# EAGLE design HID2AMI.Deluxe.Rev1.0.0.redist (EAGLE 9.1.3)
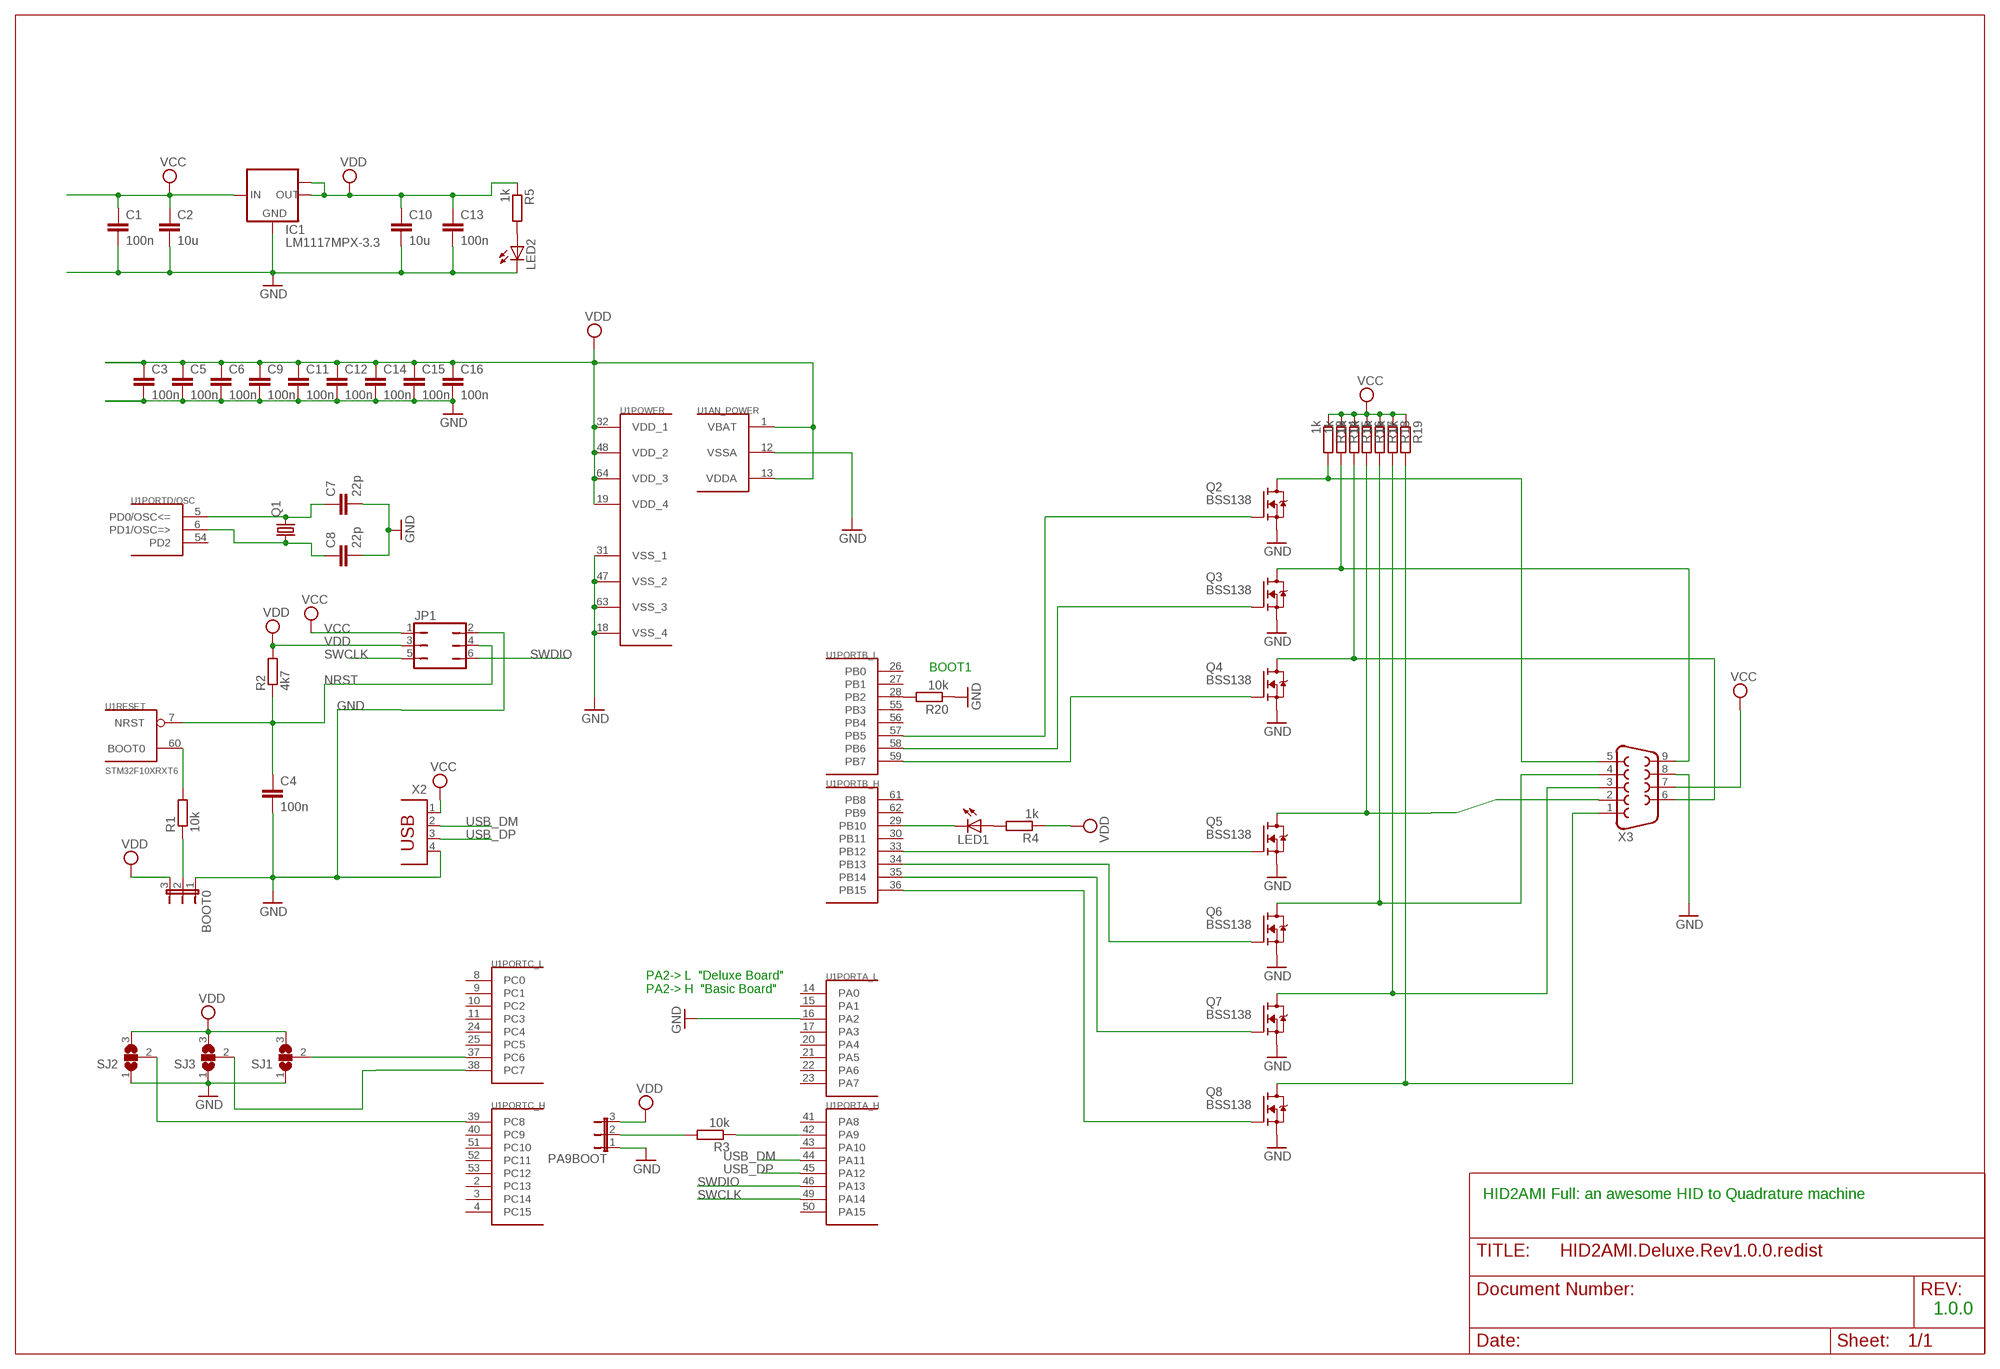
[diagram p0: schematic, sheet 1]

## Parts
BOOT0  JP2E  [JP2]
C1  100n  C-EUC0805  [C0805]
C2  10u  C-EUC1206  [C1206]
C3  100n  C-EUC0805  [C0805]
C4  100n  C-EUC0805  [C0805]
C5  100n  C-EUC0805  [C0805]
C6  100n  C-EUC0805  [C0805]
C7  22p  C-EUC0805  [C0805]
C8  22p  C-EUC0805  [C0805]
C9  100n  C-EUC0805  [C0805]
C10  10u  C-EUC0805  [C0805]
C11  100n  C-EUC0805  [C0805]
C12  100n  C-EUC0805  [C0805]
C13  100n  C-EUC0805  [C0805]
C14  100n  C-EUC0805  [C0805]
C15  100n  C-EUC0805  [C0805]
C16  100n  C-EUC0805  [C0805]
IC1  LM1117MPX-3.3  [SOT223]
JP1  JP3Q  [JP3Q]
LED1  LEDSML0805  [SML0805]
LED2  LEDSML0805  [SML0805]
PA9BOOT  JP2E  [JP2]
Q1  CRYSTALHC49S  [HC49/S]
Q2  BSS138  [SOT23]
Q3  BSS138  [SOT23]
Q4  BSS138  [SOT23]
Q5  BSS138  [SOT23]
Q6  BSS138  [SOT23]
Q7  BSS138  [SOT23]
Q8  BSS138  [SOT23]
R1  10k  R-EU_M0805  [M0805]
R2  4k7  R-EU_M0805  [M0805]
R3  10k  R-EU_M0805  [M0805]
R4  1k  R-EU_M0805  [M0805]
R5  1k  R-EU_M0805  [M0805]
R13  1k  R-EU_M0805  [M0805]
R14  1k  R-EU_M0805  [M0805]
R15  1k  R-EU_M0805  [M0805]
R16  1k  R-EU_M0805  [M0805]
R17  1k  R-EU_M0805  [M0805]
R18  1k  R-EU_M0805  [M0805]
R19  1k  R-EU_M0805  [M0805]
R20  10k  R-EU_M0805  [M0805]
SJ1  SJ2W  [SJ_2]
SJ2  SJ2W  [SJ_2]
SJ3  SJ2W  [SJ_2]
U1  STM32F10XRXT6  [TQFP64]
X2  PN87520  [PN87520]
X3  F09HP  [F09HP]

## Nets
GND: BOOT0.1 C1.2 C2.2 C3.2 C4.2 C5.2 C6.2 C7.2 C8.2 C9.2 C10.2 C11.2 C12.2 C13.2 C14.2 C15.2 C16.2 IC1.1(GND) JP1.2 LED2.C PA9BOOT.1 Q2.2(S) Q3.2(S) Q4.2(S) Q5.2(S) Q6.2(S) Q7.2(S) Q8.2(S) R20.1 SJ1.1 SJ2.1 SJ3.1 U1.12(AN_POWER:VSSA) U1.16(PORTA_L:PA2) U1.18(POWER:VSS_4) U1.31(POWER:VSS_1) U1.47(POWER:VSS_2) U1.63(POWER:VSS_3) X2.4 X3.8
N$1: C7.1 Q1.2 U1.5(PORTD/OSC:PD0/OSC<=)
N$2: C8.1 Q1.1 U1.6(PORTD/OSC:PD1/OSC=>)
N$3: R1.2 U1.60(RESET:BOOT0)
N$4: BOOT0.2 R1.1
N$5: PA9BOOT.2 R3.2
N$6: R3.1 U1.42(PORTA_H:PA9)
N$7: LED1.A R4.2
N$8: LED1.C U1.29(PORTB_H:PB10)
N$9: SJ1.2 U1.37(PORTC_L:PC6)
N$10: SJ3.2 U1.38(PORTC_L:PC7)
N$11: SJ2.2 U1.39(PORTC_H:PC8)
N$12: LED2.A R5.2
N$13: Q2.1(G) U1.57(PORTB_L:PB5)
N$14: Q3.1(G) U1.58(PORTB_L:PB6)
N$15: Q4.1(G) U1.59(PORTB_L:PB7)
N$16: Q5.1(G) U1.33(PORTB_H:PB12)
N$17: Q6.1(G) U1.34(PORTB_H:PB13)
N$18: Q7.1(G) U1.35(PORTB_H:PB14)
N$19: Q8.1(G) U1.36(PORTB_H:PB15)
N$20: R20.2 U1.28(PORTB_L:PB2)
N$34: Q2.3(D) R13.2 X3.5
N$35: Q3.3(D) R14.2 X3.9
N$36: Q4.3(D) R15.2 X3.6
N$37: Q5.3(D) R16.2 X3.2
N$38: Q6.3(D) R17.2 X3.4
N$39: Q7.3(D) R18.2 X3.3
N$40: Q8.3(D) R19.2 X3.1
NRST: C4.1 JP1.4 R2.1 U1.7(RESET:NRST)
SWCLK: JP1.5 U1.49(PORTA_H:PA14)
SWDIO: JP1.6 U1.46(PORTA_H:PA13)
USB_DM: U1.44(PORTA_H:PA11) X2.2
USB_DP: U1.45(PORTA_H:PA12) X2.3
VCC: C1.1 C2.1 IC1.3(IN) JP1.1 R13.1 R14.1 R15.1 R16.1 R17.1 R18.1 R19.1 X2.1 X3.7
VDD: BOOT0.3 C3.1 C5.1 C6.1 C9.1 C10.1 C11.1 C12.1 C13.1 C14.1 C15.1 C16.1 IC1.2(OUT) IC1.TAB(OUT1) JP1.3 PA9BOOT.3 R2.2 R4.1 R5.1 SJ1.3 SJ2.3 SJ3.3 U1.1(AN_POWER:VBAT) U1.13(AN_POWER:VDDA) U1.19(POWER:VDD_4) U1.32(POWER:VDD_1) U1.48(POWER:VDD_2) U1.64(POWER:VDD_3)
Unconnected: U1.2(PORTC_H:PC13) U1.3(PORTC_H:PC14) U1.4(PORTC_H:PC15) U1.8(PORTC_L:PC0) U1.9(PORTC_L:PC1) U1.10(PORTC_L:PC2) U1.11(PORTC_L:PC3) U1.14(PORTA_L:PA0) U1.15(PORTA_L:PA1) U1.17(PORTA_L:PA3) U1.20(PORTA_L:PA4) U1.21(PORTA_L:PA5) U1.22(PORTA_L:PA6) U1.23(PORTA_L:PA7) U1.24(PORTC_L:PC4) U1.25(PORTC_L:PC5) U1.26(PORTB_L:PB0) U1.27(PORTB_L:PB1) U1.30(PORTB_H:PB11) U1.40(PORTC_H:PC9) U1.41(PORTA_H:PA8) U1.43(PORTA_H:PA10) U1.50(PORTA_H:PA15) U1.51(PORTC_H:PC10) U1.52(PORTC_H:PC11) U1.53(PORTC_H:PC12) U1.54(PORTD/OSC:PD2) U1.55(PORTB_L:PB3) U1.56(PORTB_L:PB4) U1.61(PORTB_H:PB8) U1.62(PORTB_H:PB9)

## Notes on the sheet
- BOOT1
- PA2-> L  "Deluxe Board"
  PA2-> H  "Basic Board"
- HID2AMI Full: an awesome HID to Quadrature machine
- 1.0.0

## Library data of the parts
BOOT0 PA9BOOT = jumper:JP2E: JUMPER
C1-C16 = rcl:C-EU: CAPACITOR, European symbol; SPICEPREFIX: C
IC1 = lm1117:LM1117MPX-*
JP1 = jumper:JP3Q: JUMPER
LED1 LED2 = led:LED: LED OSRAM: - CHIPLED LG R971, LG N971, LY N971, LG Q971, LY Q971, LO R971, LY R971 LH N974, LH R974 LS Q976, LO Q976, LY Q976 LO Q996 - Hyper CHIPLED LW Q18S LB Q993, LB Q99A, LB R99A - SideLED LS A670, LO A670, LY A670, LG A670, LP A670 LB A673, LV A673, LT A673, LW A673 LH A674 LY A675 LS A676, LA A676, LO A676, LY A676, LW A676 LS A679, LY A679, LG A679 - Hyper Micro SIDELED® LS Y876, LA Y876, LO Y876, LY Y876 LT Y87S - SmartLED LW L88C, LW L88S LB L89C, LB L89S, LG L890 LS L89K, LO L89K, LY L89K LS L896, LA L896, LO L896, LY L896 - TOPLED LS T670, LO T670, LY T670, LG T670, LP T670 LSG T670, LSP T670, LSY T670, LOP T670, LYG T670 LG T671, LOG T671, LSG T671 LB T673, LV T673, LT T673, LW T673 LH T674 LS T676, LA T676, LO T676, LY T676, LB T676, LH T676, LSB T676, LW T676 LB T67C, LV T67C, LT T67C, LS T67K, LO T67K, LY T67K, LW E67C LS E67B, LA E67B, LO E67B, LY E67B, LB E67C, LV E67C, LT E67C LW T67C LS T679, LY T679, LG T679 LS T770, LO T770, LY T770, LG T770, LP T770 LB T773, LV T773, LT T773, LW T773 LH T774 LS E675, LA E675, LY E675, LS T675 LS T776, LA T776, LO T776, LY T776, LB T776 LHGB T686 LT T68C, LB T68C - Hyper Mini TOPLED® LB M676 - Mini TOPLED Santana® LG M470 LS M47K, LO M47K, LY M47K Source: http://www.osram.convergy.de LUXEON: - LUMILED® LXK2-PW12-R00, LXK2-PW12-S00, LXK2-PW14-U00, LXK2-PW14-V00 LXK2-PM12-R00, LXK2-PM12-S00, LXK2-PM14-U00 LXK2-PE12-Q00, LXK2-PE12-R00, LXK2-PE12-S00, LXK2-PE14-T00, LXK2-PE14-U00 LXK2-PB12-K00, LXK2-PB12-L00, LXK2-PB12-M00, LXK2-PB14-N00, LXK2-PB14-P00, LXK2-PB14-Q00 LXK2-PR12-L00, LXK2-PR12-M00, LXK2-PR14-Q00, LXK2-PR14-R00 LXK2-PD12-Q00, LXK2-PD12-R00, LXK2-PD12-S00 LXK2-PH12-R00, LXK2-PH12-S00 LXK2-PL12-P00, LXK2-PL12-Q00, LXK2-PL12-R00 Source: www.luxeon.com KINGBRIGHT: KA-3528ASYC Source: www.kingbright.com
Q1 = crystal:CRYSTAL: CRYSTAL; OC_FARNELL: 1667008; OC_NEWARK: unknown
Q2-Q8 = bss138_10:BSS138: BSS138 N-Channel Logic Level Enhancement Mode Field Effect Transistor Source: http://www.fairchildsemi.com/datasheets/BS/BSS138.pdf; MF: Fairchild; MPN: BSS138; OC_FARNELL: 9845330; OC_NEWARK: 67R2009
R1-R5 R13-R20 = rcl:R-EU_: RESISTOR, European symbol; SPICEPREFIX: R
SJ1-SJ3 = jumper:SJ2W: SMD solder JUMPER
U1 = stm32:STM32F10XRXT6: STM32F101/103 64pin LQFP
X2 = con-berg:PN87520: BERG USB connector; OC_FARNELL: unknown; OC_NEWARK: unknown
X3 = con-subd:F09: SUB-D; OC_FARNELL: unknown; OC_NEWARK: unknown

## Board
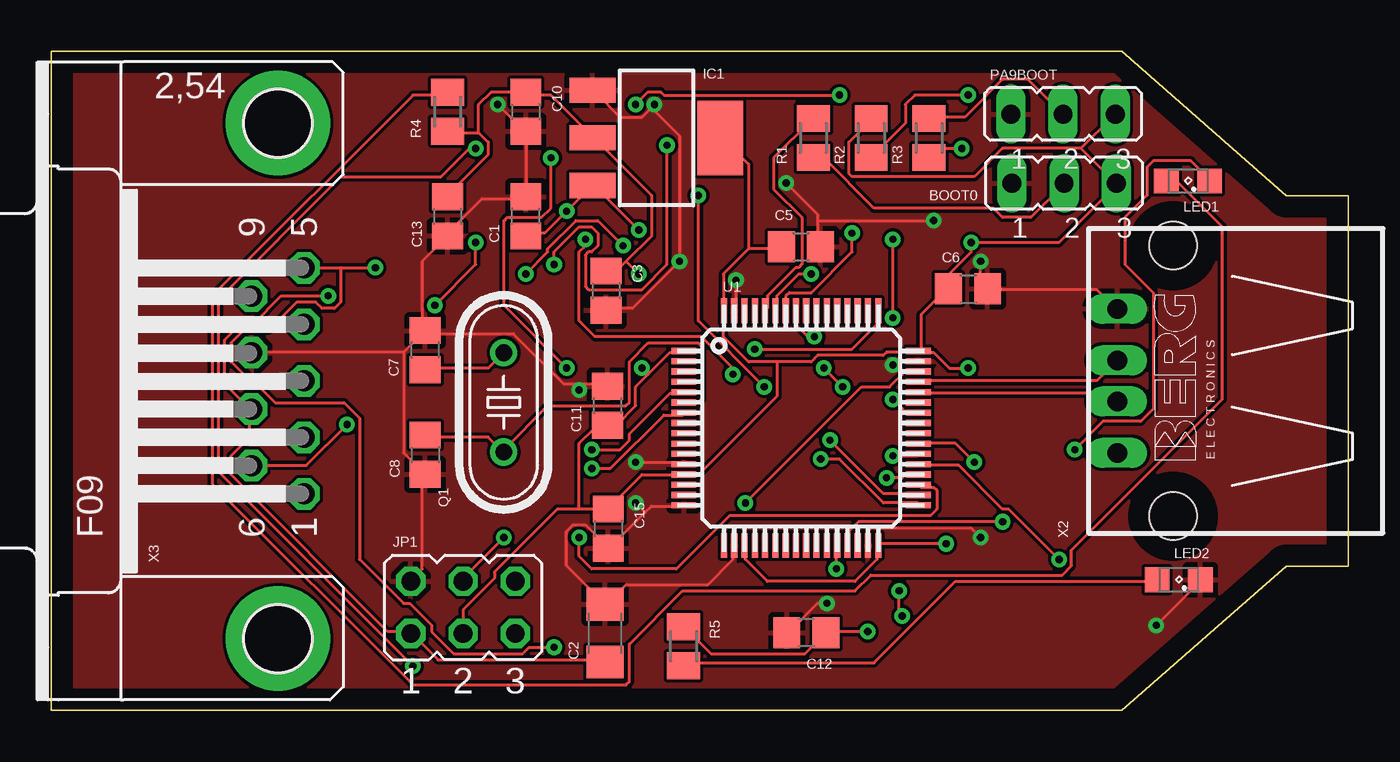
[diagram p1: board, top side]
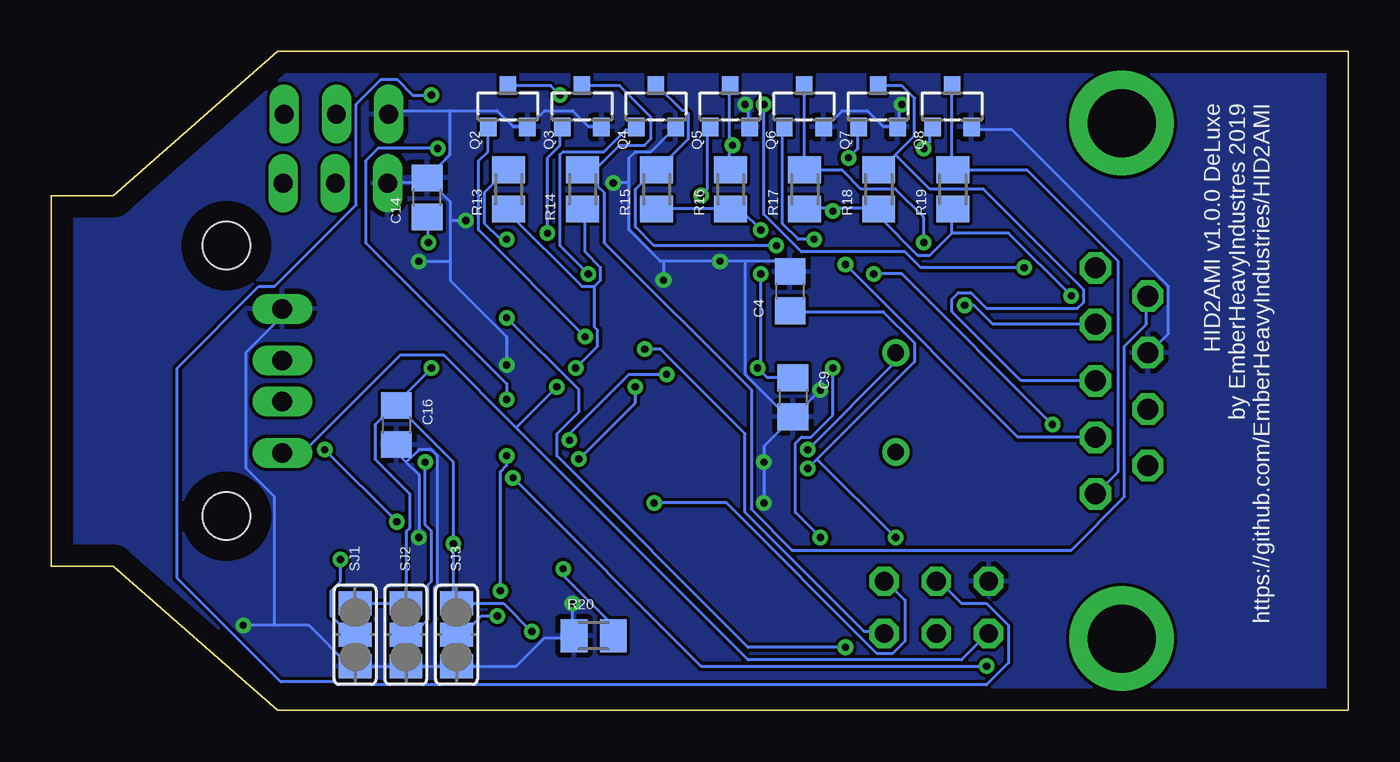
[diagram p2: board, bottom side, seen from below]

Size 63 x 32 mm. Coordinates in mm from the lower left corner, seen from the top.
Outline: 0,32 52,32 60,25 63,25 63,7 60,7 52,0 0,0 0,32
Copper layers (1*16): Top 0.035mm / dielectric 1.5mm / Bottom 0.035mm
Design rules "default": minimum track width 6mil, minimum drill 0.35mm, track to track 6mil, track to pad 6mil, pad to pad 6mil, via to via 6mil, smd to smd 6mil, copper to edge 40mil, drill to drill 6mil, minimum pad ring 10mil, minimum via ring 8mil, stop-mask expansion 4mil, vias tented up to drill 0mil, thermal gap 10mil

### Footprints (pad centres in the part's own frame; a part is rotated, then mirrored left to right if it is on the bottom)
JP2 = drill 0.914 long: 1 -2.54,0; 2 0,0; 3 2.54,0
C0805 = smd 1.3 x 1.5: 1 -0.95,0; 2 0.95,0
C1206 = smd 1.6 x 1.8: 1 -1.4,0; 2 1.4,0
SOT223 = smd 1.219 x 2.235: 1 -2.311,-3.099; 2 0,-3.099; 3 2.311,-3.099 | smd 3.6 x 2.2: TAB 0,3.099
JP3Q = drill 0.914 octagon: 1 -2.54,-1.27; 2 -2.54,1.27; 3 0,-1.27; 4 0,1.27; 5 2.54,-1.27; 6 2.54,1.27
SML0805 = smd 1.2 x 1.2: A 1.05,0; C -1.05,0
HC49/S = drill 0.813: 1 -2.413,0; 2 2.413,0
SOT23 = smd 0.8 x 0.9: 1 -0.95,-1; 2 0.95,-1; 3 0,1
M0805 = smd 1.3 x 1.6: 1 -0.95,0; 2 0.95,0
SJ_2 = smd 1.168 x 1.6: 1 -1.524,0; 2 0,0; 3 1.524,0
TQFP64 = smd 1.2 x 0.3: 1 -5.7,3.75; 2 -5.7,3.25; 3 -5.7,2.75; 4 -5.7,2.25; 5 -5.7,1.75; 6 -5.7,1.25; 7 -5.7,0.75; 8 -5.7,0.25; 9 -5.7,-0.25; 10 -5.7,-0.75; 11 -5.7,-1.25; 12 -5.7,-1.75; 13 -5.7,-2.25; 14 -5.7,-2.75; 15 -5.7,-3.25; 16 -5.7,-3.75; 33 5.7,-3.75; 34 5.7,-3.25; 35 5.7,-2.75; 36 5.7,-2.25; 37 5.7,-1.75; 38 5.7,-1.25; 39 5.7,-0.75; 40 5.7,-0.25; 41 5.7,0.25; 42 5.7,0.75; 43 5.7,1.25; 44 5.7,1.75; 45 5.7,2.25; 46 5.7,2.75; 47 5.7,3.25; 48 5.7,3.75 | smd 0.3 x 1.2: 17 -3.75,-5.7; 18 -3.25,-5.7; 19 -2.75,-5.7; 20 -2.25,-5.7; 21 -1.75,-5.7; 22 -1.25,-5.7; 23 -0.75,-5.7; 24 -0.25,-5.7; 25 0.25,-5.7; 26 0.75,-5.7; 27 1.25,-5.7; 28 1.75,-5.7; 29 2.25,-5.7; 30 2.75,-5.7; 31 3.25,-5.7; 32 3.75,-5.7; 49 3.75,5.7; 50 3.25,5.7; 51 2.75,5.7; 52 2.25,5.7; 53 1.75,5.7; 54 1.25,5.7; 55 0.75,5.7; 56 0.25,5.7; 57 -0.25,5.7; 58 -0.75,5.7; 59 -1.25,5.7; 60 -1.75,5.7; 61 -2.25,5.7; 62 -2.75,5.7; 63 -3.25,5.7; 64 -3.75,5.7
PN87520 = drill 0.95 long: 1 -3.5,2.71; 2 -1,2.71; 3 1,2.71; 4 3.5,2.71 | hole 2.3: -6.57,0; 6.57,0
F09HP = drill 1.016 octagon: 1 -5.486,-1.27; 2 -2.743,-1.27; 3 0,-1.27; 4 2.743,-1.27; 5 5.486,-1.27; 6 -4.115,1.27; 7 -1.372,1.27; 8 1.372,1.27; 9 4.115,1.27 | drill 3.302 pad 5.08: G1 -12.522,0; G2 12.522,0

### Placement (x,y rotation side)
BOOT0  49.21,25.6 0 top
C1  23.05,23.99 90 top
C2  26.9,3.75 90 top
C3  26.95,20.38 270 top
C4  27.1,20.36 90 bottom
C5  36.42,22.52 0 top
C6  44.54,20.47 0 top
C7  18.16,17.5 90 top
C8  18.16,12.42 270 top
C9  26.97,15.2 270 bottom
C10  23.05,29.07 270 top
C11  27.03,14.8 90 top
C12  36.68,3.77 180 top
C13  19.24,23.99 270 top
C14  44.74,24.91 90 bottom
C15  27.05,8.83 270 top
C16  46.24,13.86 270 bottom
IC1  29.4,27.8 270 top
JP1  20,5 0 top
LED1  55.23,25.71 180 top
LED2  54.77,6.34 180 top
PA9BOOT  49.15,28.96 0 top
Q1  21.97,14.96 90 top
Q2  40.82,29.34 0 bottom
Q3  37.22,29.34 0 bottom
Q4  33.63,29.34 0 bottom
Q5  30.03,29.34 0 bottom
Q6  26.43,29.34 0 bottom
Q7  22.84,29.34 0 bottom
Q8  19.24,29.34 0 bottom
R1  37.02,27.8 90 top
R2  39.83,27.8 90 top
R3  42.64,27.8 90 top
R4  19.24,29.07 90 top
R5  30.72,3.11 270 top
R13  40.79,25.3 90 bottom
R14  37.19,25.3 90 bottom
R15  33.6,25.3 90 bottom
R16  30,25.3 90 bottom
R17  26.4,25.3 90 bottom
R18  22.81,25.3 90 bottom
R19  19.21,25.3 90 bottom
R20  36.66,3.62 0 bottom
SJ1  48.24,3.67 90 bottom
SJ2  45.78,3.67 90 bottom
SJ3  43.32,3.67 90 bottom
U1  36.43,13.7 0 top
X2  54.5,16 90 top
X3  11,16 90 top

### Tracks (layer width: path | path; a pad name or v marks a point on that pad's centre or on a via)
GND  (via drill 0.35)
  Top 0.152: v40.88,16.78 41.03,16.93 42.1,16.93 U1.47 | v45.15,8.39 44.69,8.85 39.81,8.85 39.66,8.7 39.66,8.09 U1.31 | X2.4 51.7,19.52 50.79,20.43 45.6,20.43 C6.2 45.45,20.59 45.15,20.89 v45.15,21.81 | v37.68,5.19 37.22,5.19 35.85,3.82 C12.2 | v53.68,4.13 55.82,6.26 LED2.C | 29.15,29.27 28.69,28.82 27.62,28.82 26.4,30.03 IC1.1 | 29.15,29.27 30.52,27.9 v30.52,21.81 28.23,19.52 27.01,19.52 C3.2 | 29.15,29.27 v29.3,29.43 | 28.84,9.61 27.16,7.94 C15.2 27.01,7.94 25.95,9 25.34,9 25.03,8.7 25.03,7.02 26.86,5.19 C2.2 27.01,5.19 27.93,6.11 31.89,6.11 33.11,7.33 33.11,7.94 U1.18 | 28.84,9.61 29.15,9.92 30.67,9.92 U1.16 | v28.38,12.05 30.67,12.05 U1.12 | v33.26,20.89 33.26,19.52 U1.63 | 37.22,23.79 37.22,24.09 v35.7,25.62 | 37.22,23.79 37.22,22.57 C5.2 | v28.38,10.07 28.84,9.61 | JP1.2 17.56,6.41 18.02,6.87 18.02,11.44 C8.2 18.02,11.59 17.11,12.51 17.11,17.39 | 23.05,28.05 C1.2 23.05,24.85 20.92,24.85 19.24,23.18 C13.2 19.24,23.02 18.02,21.81 18.02,18.45 C7.2 | 23.05,28.05 v21.68,29.43 | 23.05,28.05 C10.2 | 25.64,15.86 24.88,15.86 22.44,18.3 18.17,18.3 C7.2 | 25.64,15.86 27.01,15.86 C11.2 | 17.11,17.39 18.02,18.3 C7.2 | 17.11,17.39 9.79,17.39 X3.8 | 25.64,15.86 v25.64,15.56 | 37.22,23.79 v42.86,23.79
  Bottom 0.152: Q3.2 36.31,28.36 36.92,28.36 37.68,29.12 39.05,29.12 39.81,28.36 Q2.2 39.97,28.36 40.58,28.36 41.34,29.12 43.62,29.12 | 43.62,29.12 46.37,29.12 46.52,28.97 PA9BOOT.1 | v40.88,16.78 40.88,18.15 43.62,20.89 43.62,21.81 | 43.62,23.79 43.62,24.7 44.69,25.77 C14.2 | 43.62,23.79 43.62,21.81 | BOOT0.1 46.52,25.62 45,25.62 44.84,25.77 C14.2 | 43.62,29.12 43.62,26.99 44.69,25.92 C14.2 | v45.15,8.39 45.15,11.44 45.76,12.05 | 45.76,12.05 46.22,12.51 46.22,12.81 C16.2 | v37.68,5.19 37.68,3.67 R20.1 37.68,3.52 39.05,3.52 40.42,2.15 SJ3.1 44.39,2.15 | 44.39,2.15 SJ2.1 SJ1.1 48.5,2.15 50.48,4.13 52.16,4.13 | 52.16,4.13 v53.68,4.13 | 52.16,4.13 52.16,10.38 53.53,11.75 53.53,17.39 51.85,19.06 51.85,19.37 X2.4 | 45.76,12.05 45.15,12.66 44.54,12.66 44.23,12.36 44.23,6.11 44.39,5.96 44.39,2.15 | v45.15,21.81 43.62,21.81 | v29.3,29.43 29.15,29.27 29.15,28.36 Q5.2 | C9.2 27.01,14.19 28.38,12.81 v28.38,12.05 v28.38,10.07 | 34.94,25.62 34.94,23.33 33.41,21.81 33.26,21.81 | 34.94,25.62 34.94,26.84 34.63,27.14 33.87,27.14 32.8,28.21 Q4.2 | 29.3,21.81 27.62,21.81 27.16,21.35 C4.2 | 29.3,21.81 v30.52,21.81 33.26,21.81 | 33.26,21.81 v33.26,20.89 | 34.94,25.62 v35.7,25.62 | 29.3,21.81 29.3,16.32 27.32,14.34 27.01,14.34 C9.2 | Q8.2 18.17,28.21 16.34,28.21 8.72,20.59 8.72,18.3 9.64,17.39 X3.8 | Q6.2 25.34,28.36 24.57,29.12 23.36,29.12 22.59,28.36 21.98,28.36 Q7.2 21.83,28.36 21.83,29.27 v21.68,29.43 | v25.64,15.56 26.86,14.34 C9.2 | v42.86,23.79 43.62,23.79
  pour Top: 0,32 52,32 60,25 63,25 63,7 60,7 52,0 0,0
  pour Bottom: 0,32 52,32 60,25 63,25 63,7 60,7 52,0 0,0
N$1  (via drill 0.35)
  Top 0.152: v26.25,12.66 27.62,12.66 28.08,13.12 28.08,13.42 30.06,15.41 30.67,15.41 U1.5 | C7.1 18.17,16.62 21.22,16.62 21.83,17.23 Q1.2
  Bottom 0.152: v26.25,12.66 21.98,16.93 21.98,17.23 Q1.2
N$2
  Top 0.152: U1.6 30.82,14.95 31.43,14.95 31.58,15.1 31.58,17.69 31.43,17.84 28.99,17.84 28.08,16.93 28.08,14.95 27.93,14.8 24.12,14.8 21.98,12.66 Q1.1 21.83,12.66 21.22,13.27 18.17,13.27 C8.1
N$3
  Top 0.152: U1.60 34.78,19.52 34.78,20.13 36.16,21.5 36.31,21.5 36.46,21.65 36.46,23.94 35.09,25.31 35.09,26.84 36.92,28.66 R1.2
N$4
  Top 0.152: R1.1 37.07,26.84 37.53,26.84 39.97,24.4 45.76,24.4 46.22,23.94 47.59,23.94 49.11,25.46 BOOT0.2
N$5
  Top 0.152: R3.2 42.71,28.82 44.39,28.82 46.22,30.65 47.43,30.65 49.11,28.97 PA9BOOT.2
N$6  (via drill 0.35)
  Top 0.152: v40.88,15.1 41.49,14.49 42.1,14.49 U1.42 | v44.23,27.29 43.01,27.29 42.71,26.99 R3.1
  Bottom 0.152: v40.88,15.1 40.88,15.86 47.74,22.72 47.74,26.68 47.13,27.29 v44.23,27.29
N$7
  Top 0.152: LED1.A 54.29,25.62 54.75,25.62 56.88,23.48 56.88,15.1 49.57,7.79 49.57,7.02 49.11,6.57 39.81,6.57 39.05,5.8 30.67,5.8 28.08,3.21 28.08,1.38 27.93,1.23 17.56,1.23 7.81,10.98 7.81,20.13 17.56,29.88 19.24,29.88 R4.2
N$8  (via drill 0.35)
  Top 0.152: v46.22,9.16 39.2,9.16 38.75,8.7 38.75,8.09 U1.29 | v49.72,12.66 51.09,14.03 52.92,14.03 53.53,14.64 53.53,20.28 52.16,21.65 52.16,23.94 53.23,25.01 53.23,26.38 53.53,26.68 55.36,26.68 56.27,25.77 LED1.C
  Bottom 0.152: v49.72,12.66 v46.22,9.16
N$9  (via drill 0.35)
  Top 0.152: v48.96,7.33 46.52,9.77 46.22,9.77 44.08,11.9 42.25,11.9 U1.37
  Bottom 0.152: v48.96,7.33 48.96,6.26 49.41,5.8 49.41,4.58 48.5,3.67 SJ1.2
N$10  (via drill 0.35)
  Top 0.152: v40.88,12.36 42.1,12.36 U1.38 | v41.19,5.8 41.19,4.74 v41.34,4.58
  Bottom 0.152: v40.88,12.36 40.88,11.9 41.19,11.59 v41.19,5.8 | v41.34,4.58 42.1,4.58 43.01,3.67 SJ3.2
N$11  (via drill 0.35)
  Top 0.152: v44.84,12.05 43.93,12.97 42.25,12.97 U1.39
  Bottom 0.152: v44.84,12.05 44.84,9 44.54,8.7 44.54,6.26 44.69,6.11 44.69,4.43 45.45,3.67 SJ2.2
N$12
  Top 0.152: LED2.A 53.68,6.26 43.93,6.26 39.97,2.3 30.82,2.3 R5.2
N$13  (via drill 0.35)
  Top 0.152: v37.07,18.15 36.77,18.15 36.16,18.76 36.16,19.37 U1.57
  Bottom 0.152: v37.07,18.15 42.25,23.33 42.25,26.68 41.8,27.14 41.8,28.21 Q2.1
N$14  (via drill 0.35)
  Top 0.152: v38.9,23.18 38.9,22.26 36.92,20.28 35.85,20.28 35.7,20.13 35.7,19.52 U1.58
  Bottom 0.152: v38.9,23.18 38.9,26.84 38.29,27.44 38.29,28.21 Q3.1
N$15  (via drill 0.35)
  Top 0.152: v36.92,21.2 36.31,21.2 35.24,20.13 35.24,19.52 U1.59
  Bottom 0.152: v36.92,21.2 38.29,22.57 38.29,26.99 38.14,27.14 36.16,27.14 35.09,28.21 34.63,28.21 Q4.1
N$16  (via drill 0.35)
  Top 0.152: v31.43,25.01 31.43,18.91 v34.63,15.71 | v37.38,12.2 38.29,12.2 40.42,10.07 42.1,10.07 U1.33
  Bottom 0.152: v31.43,25.01 31.13,25.31 31.13,28.21 Q5.1 | v34.63,15.71 34.63,14.95 v37.38,12.2
N$17  (via drill 0.35)
  Top 0.152: v25.95,22.87 25.95,22.57 25.64,22.26 25.64,18.91 26.4,18.15 31.58,18.15 33.11,16.62 v33.11,16.32 | v37.83,13.12 40.42,10.53 42.1,10.53 U1.34
  Bottom 0.152: v25.95,22.87 26.71,22.87 27.47,23.63 27.47,28.21 Q6.1 | v33.11,16.32 34.94,16.32 37.83,13.42 v37.83,13.12
N$18  (via drill 0.35)
  Top 0.152: v24.27,26.84 24.27,24.4 23.81,23.94 22.14,23.94 21.98,23.79 21.98,19.67 v25.03,16.62 | v25.64,8.39 25.64,7.48 26.25,6.87 30.36,6.87 32.96,9.46 42.71,9.46 43.01,9.77 43.01,10.68 42.86,10.83 42.25,10.83 U1.35
  Bottom 0.152: v24.27,26.84 23.81,27.29 23.81,28.21 Q7.1 | v25.03,16.62 25.03,14.34 26.1,13.27 26.55,13.27 26.86,12.97 26.86,9.61 v25.64,8.39
N$19  (via drill 0.35)
  Top 0.152: v20.61,27.29 20.31,27.29 18.94,25.92 14.06,25.92 8.12,19.98 8.12,11.59 v17.56,2.15 | v40.58,11.29 41.34,11.29 41.49,11.44 42.1,11.44 U1.36
  Bottom 0.152: v20.61,27.29 20.31,27.6 20.31,28.21 Q8.1 | v17.56,2.15 31.43,2.15 v40.58,11.29
N$20  (via drill 0.35)
  Top 0.152: v38.14,6.87 38.14,7.94 U1.28
  Bottom 0.152: v38.14,6.87 38.14,6.57 35.85,4.28 35.85,3.67 R20.2
N$34  (via drill 0.35)
  Top 0.152: v38.29,29.88 29.76,29.88 29.6,30.03 28.99,30.03 v28.38,29.43 | 14.06,21.5 12.38,21.5 X3.5 | 14.06,21.5 v15.73,21.5 | v40.88,19.06 v40.88,22.87 | v24.42,3.06 23.2,3.06 22.9,2.76 19.55,2.76 18.48,3.82 18.48,4.13 17.41,5.19 17.11,5.19 14.97,7.33 14.97,14.19 14.21,14.95 10.86,14.95 9.49,16.32 9.33,16.32 8.72,16.93 8.72,17.84 9.33,18.45 10.55,18.45 11.93,19.82 12.84,19.82 13.14,19.52 13.75,19.52 14.06,19.82 14.06,21.5
  Bottom 0.152: Q2.3 38.75,30.34 v38.29,29.88 | v28.38,29.43 28.38,24.09 26.55,22.26 21.53,22.26 20.76,21.5 v15.73,21.5 | v40.88,22.87 41.19,22.87 41.95,23.63 41.95,25.16 40.88,26.23 R13.2 | v40.88,19.06 37.38,15.56 37.38,14.49 38.44,13.42 38.44,12.36 29.15,3.06 v24.42,3.06
N$35
  Bottom 0.152: Q3.3 35.39,30.34 33.87,28.82 33.87,27.75 34.17,27.44 35.39,27.44 36.46,26.38 | 36.46,26.38 37.07,26.38 R14.2 36.46,26.38 | 36.46,26.38 36.46,25.46 36.16,25.16 36.16,22.72 28.99,15.56 28.99,9.77 27.01,7.79 13.45,7.79 10.86,10.38 10.86,17.69 9.79,18.76 9.79,19.98 X3.9
N$36  (via drill 0.35)
  Top 0.152: v27.77,22.57 26.55,23.79 25.49,23.79 24.12,22.41 24.12,22.26 v23.05,21.2 | v14.36,13.88 12.38,11.9 9.79,11.9 X3.6
  Bottom 0.152: Q4.3 33.57,30.34 32.35,29.12 32.19,29.12 32.04,28.97 32.04,27.75 33.57,26.23 R15.2 33.72,26.23 34.63,25.31 34.63,23.48 33.72,22.57 v27.77,22.57 | v23.05,21.2 21.68,21.2 v14.36,13.88
N$37  (via drill 0.35)
  Top 0.152: v29.91,27.44 29.91,21.65 28.69,20.43 26.1,20.43 25.95,20.59 25.95,22.11 26.1,22.26 26.25,22.26 26.55,22.57 26.55,23.18 26.25,23.48 25.64,23.48 24.42,22.26 v24.42,21.65
  Bottom 0.152: 30.06,27.44 30.06,26.38 R16.2 | 30.06,27.44 30.06,30.34 Q5.3 | v29.91,27.44 30.06,27.44 | v24.42,21.65 16.04,13.27 12.38,13.27 X3.2
N$38  (via drill 0.35)
  Top 0.152: v20.61,22.72 20.61,21.65 v18.63,19.67
  Bottom 0.152: Q6.3 26.4,30.34 26.4,26.38 R17.2 26.25,26.23 24.57,26.23 23.66,25.31 21.98,25.31 20.61,23.94 v20.61,22.72 | v18.63,19.67 18.17,19.67 17.26,18.76 12.38,18.76 X3.4
N$39
  Bottom 0.152: Q7.3 21.68,30.34 21.07,29.73 21.07,27.9 21.98,26.99 | 21.98,26.99 22.75,26.23 R18.2 | 21.98,26.99 20.31,25.31 17.72,25.31 12.84,20.43 12.84,19.82 13.14,19.52 17.56,19.52 18.33,20.28 18.94,20.28 19.24,19.98 19.24,19.37 15.89,16.01 12.38,16.01 X3.3
N$40
  Bottom 0.152: Q8.3 19.24,26.38 R19.2 19.09,26.23 15.58,26.23 11.16,21.81 11.16,11.59 12.23,10.53 X3.1
NRST  (via drill 0.35)
  Top 0.152: v26.25,11.75 27.16,11.75 29.76,14.34 30.67,14.34 U1.7 | v44.54,29.88 41.95,29.88 41.49,29.43 41.49,28.51 39.97,26.99 R2.1 | v21.98,8.39 20,6.41 JP1.4
  Bottom 0.152: 25.79,12.2 21.07,16.93 21.07,17.84 22.59,19.37 27.01,19.37 C4.1 | 25.79,12.2 v26.25,11.75 | v44.54,29.88 45.45,29.88 46.22,30.65 46.98,30.65 48.2,29.43 48.2,24.55 52.16,20.59 52.92,20.59 56.88,16.62 56.88,6.41 51.85,1.38 49.26,1.38 49.11,1.23 17.56,1.23 16.5,2.3 16.5,4.13 17.56,5.19 18.78,5.19 19.85,6.26 JP1.4 | v21.98,8.39 25.79,12.2
SWCLK  (via drill 0.35)
  Top 0.152: v34.17,17.54 38.9,17.54 40.12,18.76 40.12,19.37 U1.49
  Bottom 0.152: v34.17,17.54 33.41,17.54 29.3,13.42 29.3,9.61 23.51,3.82 22.59,3.82 JP1.5
SWDIO  (via drill 0.35)
  Top 0.152: v33.72,10.07 39.36,15.71 40.73,15.71 41.49,16.47 42.1,16.47 U1.46
  Bottom 0.152: v33.72,10.07 30.21,10.07 22.9,2.76 22.14,2.76 21.53,3.36 21.53,5.35 22.44,6.26 JP1.6
USB_DM
  Top 0.152: U1.44 42.25,15.41 51.4,15.41 51.7,15.1 X2.2
USB_DP
  Top 0.152: U1.45 42.25,16.01 50.79,16.01 51.7,16.93 X2.3
VCC  (via drill 0.35)
  Top 0.152: C1.1 23.05,23.18 23.96,23.18 v25.03,24.24 26.25,25.46 IC1.3 26.4,25.46 v28.54,23.33 | C2.1 26.86,2.45 18.78,2.45 17.56,3.67 JP1.1 17.41,3.82 16.34,3.82 8.72,11.44 8.72,12.36 9.64,13.27 9.64,14.49 X3.7 9.64,14.64 8.42,15.86 8.42,18 9.18,18.76 9.79,18.76 11.16,20.13 v13.45,20.13 | v38.44,15.71 v37.53,16.62
  Bottom 0.152: 19.24,23.18 19.24,24.24 R19.1 | 19.24,23.18 20.31,22.11 20.92,22.11 22.75,23.94 22.75,24.24 R18.1 22.9,24.4 25.03,24.4 | 25.03,24.4 26.25,24.4 R17.1 | R15.1 33.57,24.4 30.06,24.4 R16.1 29.91,24.24 29.45,24.24 v28.54,23.33 | v25.03,24.24 25.03,24.4 | 36.61,20.59 36.31,20.89 36.31,21.5 37.07,22.26 37.07,24.24 R14.1 | 36.61,20.59 37.22,20.59 40.88,24.24 R13.1 | 40.42,13.73 29.15,2.45 18.78,2.45 17.56,3.67 JP1.1 | 40.42,13.73 43.93,17.23 46.06,17.23 50.79,12.51 51.7,12.51 X2.1 | 36.61,20.59 36.61,18.6 36.46,18.45 36.46,17.69 v37.53,16.62 | 40.42,13.73 v38.44,15.71 | 19.24,23.18 16.5,23.18 v13.45,20.13
VDD  (via drill 0.35)
  Top 0.152: 20.76,28.05 21.22,27.6 21.22,26.99 19.24,25.01 C13.1 | 20.76,28.05 19.24,28.05 R4.1 | 20.76,28.05 20.76,29.43 21.37,30.03 23.05,30.03 C10.1 23.05,29.88 24.27,29.88 26.25,27.9 IC1.2 26.4,27.75 29.15,25.01 29.15,23.02 27.93,21.81 | 27.93,21.81 27.47,21.35 27.01,21.35 C3.1 | 28.99,16.32 28.38,15.71 28.38,14.8 27.47,13.88 27.16,13.88 C11.1 27.01,13.73 26.4,13.73 25.64,12.97 25.64,9.77 | 28.99,16.32 30.06,17.39 30.67,17.39 U1.1 | 28.99,16.32 v28.69,16.62 | 25.64,9.77 27.01,9.77 C15.1 27.16,9.92 28.69,11.44 30.67,11.44 U1.13 30.82,11.44 31.43,11.44 35.24,15.25 35.24,16.93 | 25.64,9.77 24.57,9.77 21.53,6.72 21.53,6.41 20,4.89 20,3.82 JP1.3 | v28.54,21.2 27.93,21.81 | R5.1 30.82,3.98 32.04,2.76 36.61,2.76 37.53,3.67 C12.1 37.68,3.82 v39.66,3.82 | U1.19 33.72,7.94 33.72,7.33 34.78,6.26 39.05,6.26 40.12,7.33 40.12,7.94 U1.32 40.27,8.09 v43.47,8.09 | 33.87,22.41 32.65,21.2 32.65,19.52 U1.64 32.65,19.37 32.65,18.15 33.87,16.93 35.24,16.93 | 33.87,22.41 35.39,22.41 C5.1 | 33.87,22.41 33.87,26.53 32.65,27.75 IC1.TAB | U1.48 42.25,17.54 42.25,19.22 43.47,20.43 C6.1 43.62,20.59 43.62,21.2 44.69,22.26 v44.69,22.72 48.96,22.72 51.7,25.46 BOOT0.3 51.7,25.62 50.02,27.29 | 50.02,27.29 46.22,27.29 44.84,25.92 38.9,25.92 38.75,26.07 38.75,27.6 39.81,28.66 R2.2 | 50.02,27.29 51.55,28.82 PA9BOOT.3 | 35.24,16.93 36.92,16.93 37.22,17.23 40.42,17.23 40.58,17.39 42.1,17.39 U1.48 | v44.54,16.62 43.62,16.62 42.86,17.39 42.25,17.39 U1.48
  Bottom 0.152: 28.54,16.47 28.23,16.17 27.01,16.17 C9.1 | 28.54,16.47 v28.54,21.2 | 28.54,16.47 v28.69,16.62 | SJ1.3 SJ2.3 45.76,5.19 45.76,8.7 45.6,8.85 45.6,10.53 47.28,12.2 47.28,13.88 46.37,14.8 C16.1 | C16.1 46.22,14.8 43.47,12.05 v43.47,8.09 43.47,5.19 SJ3.3 41.03,5.19 v39.66,3.82 | v44.69,22.72 44.69,23.94 C14.1 | v44.54,16.62 46.22,14.95 C16.1

### Text on the board
bPlace: HID2AMI v1.0.0 DeLuxe / by EmberHeavyIndustres 2019 / https://github.com/EmberHeavyIndustries/HID2AMI